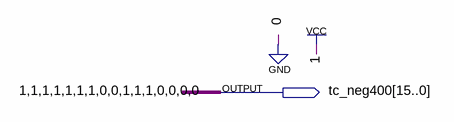
[diagram p0: schematic sheet]
// Quartus schematic tc_neg400.bdf as structural Verilog: 0 symbols, 1 pins
module tc_neg400 (
  output [15:0] tc_neg400
);


  assign tc_neg400 = 16'b1111111001110000;
endmodule
